# Altium schematic sheet P6.SchDoc: DIO MCX 16 Isolated
size A4; DocumentNumber: 7; SheetNumber: 7; SheetTotal: 7; ModifiedBy: -; CreateDate: XX/XX/XXXX; CheckedDate: -; Title2: Title2; DivGrp: CTI
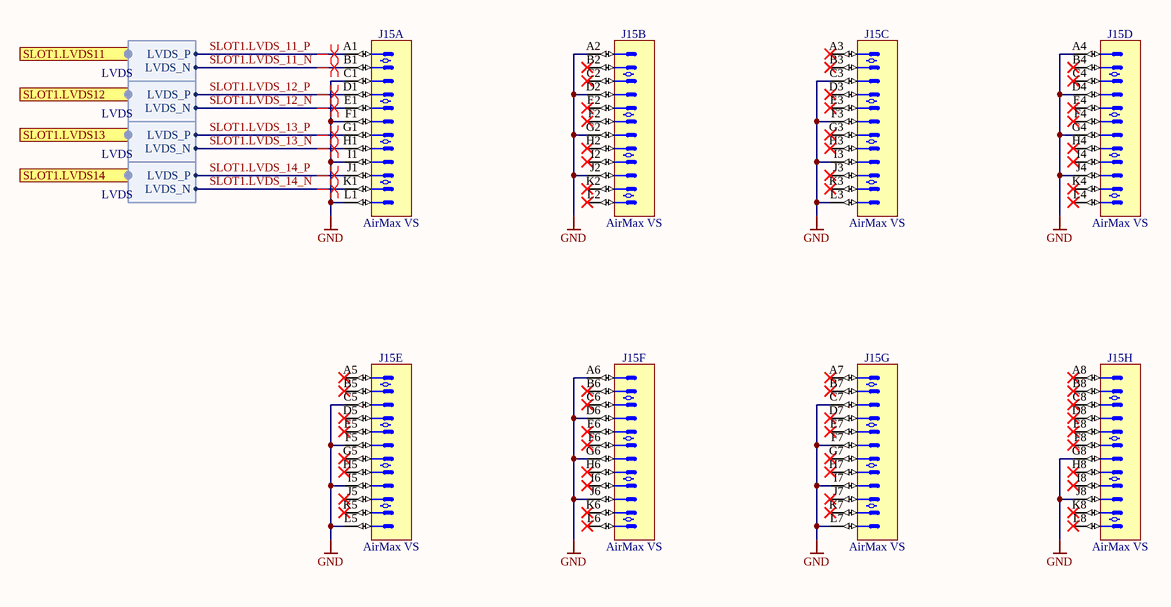
[diagram p0: P6.SchDoc]

## Parts
J15  AirMax VS  [AMPHENOL_10052838-101LF]  (parts A,B,C,D,E,F,G,H of 8)

## Ports
SLOT1.LVDS11 (harness LVDS), SLOT1.LVDS12 (harness LVDS), SLOT1.LVDS13 (harness LVDS), SLOT1.LVDS14 (harness LVDS)

## Harnesses
LVDS: LVDS_P, LVDS_N

## Nets
GND: J15.A2 J15.A4 J15.A6 J15.C1 J15.C3 J15.C5 J15.C7 J15.D2 J15.D4 J15.D6 J15.F1 J15.F3 J15.F5 J15.F7 J15.G2 J15.G4 J15.G6 J15.G8 J15.I1 J15.I3 J15.I5 J15.I7 J15.J2 J15.J4 J15.J6 J15.J8 J15.L1 J15.L3 J15.L5 J15.L7
SLOT1.LVDS_11_N: J15.B1 ; port SLOT1.LVDS11.LVDS_N
SLOT1.LVDS_11_P: J15.A1 ; port SLOT1.LVDS11.LVDS_P
SLOT1.LVDS_12_N: J15.E1 ; port SLOT1.LVDS12.LVDS_N
SLOT1.LVDS_12_P: J15.D1 ; port SLOT1.LVDS12.LVDS_P
SLOT1.LVDS_13_N: J15.H1 ; port SLOT1.LVDS13.LVDS_N
SLOT1.LVDS_13_P: J15.G1 ; port SLOT1.LVDS13.LVDS_P
SLOT1.LVDS_14_N: J15.K1 ; port SLOT1.LVDS14.LVDS_N
SLOT1.LVDS_14_P: J15.J1 ; port SLOT1.LVDS14.LVDS_P

Not connected (* = marked no-connect by the designer): J15 A3* A5* A7* A8* B2* B3* B4* B5* B6* B7* B8* C2* C4* C6* C8* D3* D5* D7* D8* E2* E3* E4* E5* E6* E7* E8* F2* F4* F6* F8* G3* G5* G7* H2* H3* H4* H5* H6* H7* H8* I2* I4* I6* I8* J3* J5* J7* K2* K3* K4* K5* K6* K7* K8* L2* L4* L6* L8*

## Layout directives
differential pair: SLOT1.LVDS_11_N, SLOT1.LVDS_11_P, SLOT1.LVDS_12_N, SLOT1.LVDS_12_P, SLOT1.LVDS_13_N, SLOT1.LVDS_13_P, SLOT1.LVDS_14_N, SLOT1.LVDS_14_P

## Notes on the sheet
- ARTIQ
- Project
- Name
- Sheet
- 2020
- Size
- A4
- of
- 1.0
- Rev
- Copyright WUT ISE 2020.
  This document describes Open Hardware and is licensed under the CERN-OHL-S v2
  You may redistribute and modify this documentation and make products using it under the terms of the CERN-OHL-S v2 (https:/cern.ch/cern-ohl). This documentation is distributed WITHOUT ANY EXPRESS OR IMPLIED WARRANTY, INCLUDING OF MERCHANTABILITY, SATISFACTORY QUALITY AND FITNESS FOR A PARTICULAR PURPOSE. Please see the CERN-OHL-S v2 for applicable conditions.
  As per CERN-OHL-S v2 section 4, should You produce hardware based on these sources, You must maintain the Source Location visible on the silkscreen or top copper for a DI/OT System Board PCB or other product you make using this documentation.
- -------------------------------

## Library data of the parts
J15 = AMPHENOL_10052838-101LF: 96 Contacts Header, 8 Columns, 4 Pairs per Column; Part Description: 96 Contacts, 2mm Pitch, 8 Columns, 4 Pairs per Column, 4 Walls, Right Angle Header; Part Number: AMPHENOL_10052838-101LF; Component Kind: Standard; Component Type: Standard; Pin Count: 96; Family: AirMax VS; Mounted: Yes; Socket: No; SMD: No; PressFit: Yes; Sense: No; Status: None; Manufacturer: AMPHENOL; Manufacturer Part Number: 10052838-101LF; ComponentHeight: 15.35mm; HelpURL: \\cern.ch\dfs\Applications\Altium\Datasheets\AMPHENOL_10052838-101LF.pdf; ComponentLink1URL: \\cern.ch\dfs\Applications\Altium\Datasheets\AMPHENOL_10052838-101LF_Application.pdf; ComponentLink1Description: Application; Author: CERN DEM MR; CreateDate: 19/02/2018; LatestRevisionDate: 19/02/2018